# Altium project Service_eval_board.PrjPcb (part 3 of 3)

## Sheet Regulators.SchDoc
size A4; DocumentNumber: 7; SheetNumber: 7; SheetTotal: 10
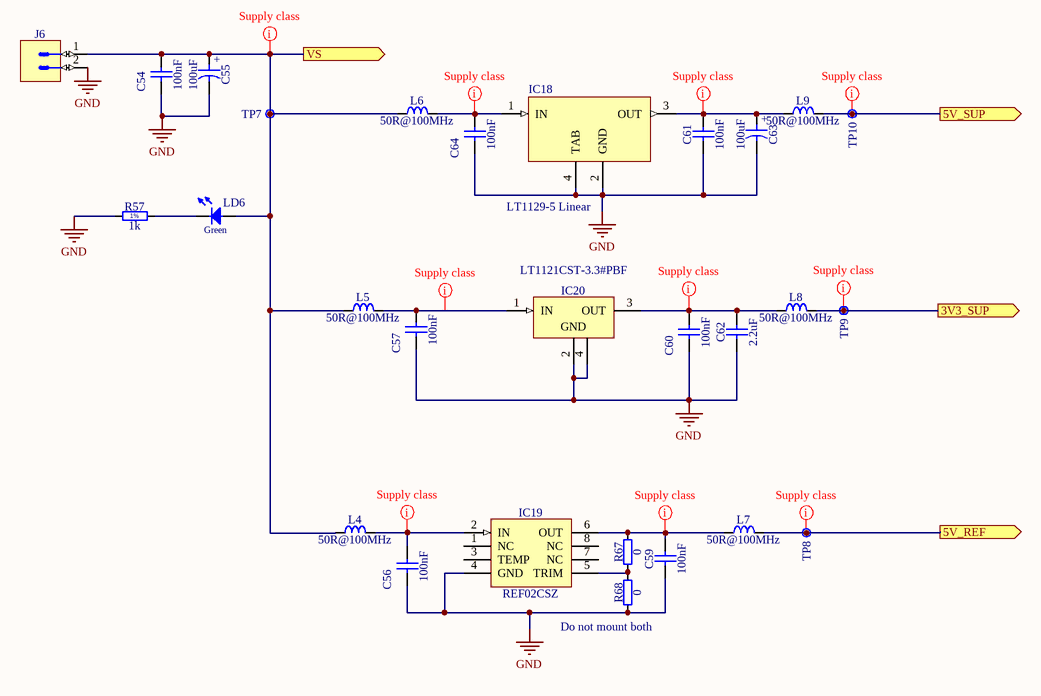
[diagram p9: Regulators.SchDoc]

### Parts
C54  100nF  [CAPC2012X135N]
C55  100uF  [CAPAE660X540N]
C56  100nF  [CAPC2012X135N]
C57  100nF  [CAPC2012X135N]
C59  100nF  [CAPC2012X135N]
C60  100nF  [CAPC2012X135N]
C61  100nF  [CAPC2012X135N]
C62  2.2uF  [CAPC2012X135N]
C63  100uF  [CAPAE660X540N]
C64  100nF  [CAPC2012X135N]
IC18  LT1129-5 Linear  [SOT230P700X175-4N]
IC19  REF02CSZ  [SOIC127P600X175-8N]
IC20  LT1121CST-3.3#PBF  [SOT230P700X180-4N]
J6  MATE-N-LOK  [TYCO_350786-1]  (value not drawn)
L4  50R@100MHz  [IND_MURATA_BLM31PG]
L5  50R@100MHz  [IND_MURATA_BLM31PG]
L6  50R@100MHz  [IND_MURATA_BLM31PG]
L7  50R@100MHz  [IND_MURATA_BLM31PG]
L8  50R@100MHz  [IND_MURATA_BLM31PG]
L9  50R@100MHz  [IND_MURATA_BLM31PG]
LD6  Green  [LED_OSRAM_LGR971]  (value not drawn)
R57  1k  [RESC2012X60N]
R67  0  [RESC2012X60N]
R68  0  [RESC2012X60N]
TP7  Test Point  [VERO_20-2136]  (value not drawn)
TP8  Test Point  [VERO_20-2136]  (value not drawn)
TP9  Test Point  [VERO_20-2136]  (value not drawn)
TP10  Test Point  [VERO_20-2136]  (value not drawn)

### Ports
3V3_SUP (out), 5V_REF (out), 5V_SUP (out), VS (out)

### Nets
DVDD: L8.2 TP9.1 ; port 3V3_SUP
GND: C54.1 C55.2 C56.1 C57.1 C59.1 C60.1 C61.1 C62.1 C63.2 C64.1 IC18.2(GND) IC18.4(TAB) IC19.4(GND) IC20.2(GND) IC20.4(GND) J6.2 R57.1 R68.1
NetC2_1: C54.2 C55.1 J6.1 L4.1 L5.1 L6.1 LD6.2(A) TP7.1 ; port VS
NetC45_1_1: L9.2 TP10.1 ; port 5V_SUP
NetC56_2: C56.2 IC19.2(IN) L4.2
NetC57_2: C57.2 IC20.1(IN) L5.2
NetC59_2: C59.2 IC19.6(OUT) L7.1 R67.2
NetC60_2: C60.2 C62.2 IC20.3(OUT) L8.1
NetC61_2: C61.2 C63.1 IC18.3(OUT) L9.1
NetC64_2: C64.2 IC18.1(IN) L6.2
NetIC19_5: IC19.5(TRIM) R67.1 R68.2
NetL7_2: L7.2 TP8.1 ; port 5V_REF
NetLD6_1: LD6.1(C) R57.2

Not connected (* = marked no-connect by the designer): IC19 1(NC) 3(TEMP) 7(NC) 8(NC)

### Layout directives
net class Supply: DVDD, NetC2_1, NetC45_1_1, NetC56_2, NetC57_2, NetC59_2, NetC60_2, NetC61_2, NetC64_2, NetL7_2

### Notes on the sheet
- (near R68) Do not mount both
- (in symbol CAE660-540_100UF_16V_20%) +
- (in symbol R0805_1K_1%_0.125W_100PPM) 1%

### Library data of the parts
C54 C56 C57 C59-C61 C64 = CC0805_100NF_50V_10%_X7R: as C51-C53 on sheet DAC; Part Number: CC0805_100NF_50V_10%_X7R; Component Kind: Standard; Component Type: Standard; Pin Count: 2; Value: 100nF; Status: Preferred; Manufacturer Part Number: CC0805_100NF_50V_10%_X7R; Case: 0805; Mounted: Yes; Socket: No; SMD: Yes; Sense: No; Manufacturer1 Example: TDK; Manufacturer1 ComponentHeight: 1mm; HelpURL: \\cern.ch\dfs\Applications\Altium\Datasheets\CC0805_X7R_TDK_C.pdf; Author: CERN DEM JLC; CreateDate: 03.12.2007; LatestRevisionDate: 22.04.2015
C55 C63 = CAE660-540_100UF_16V_20%: Polarised capacitor; Part Description: Aluminum Electrolytic SMT Capacitor; Manufacturer: PANASONIC; Manufacturer Part Number: EEEFK1C101AP; Voltage: 16V; Tolerance: ±20%; Part Number: CAE660-540_100UF_16V_20%; Component Kind: Standard; Component Type: Standard; Pin Count: 2; Value: 100uF; Status: Not Recommended; Case: D; Mounted: Yes; Socket: No; SMD: Yes; Sense: No; ComponentHeight: 5.8mm; HelpURL: \\cern.ch\dfs\Applications\Altium\Datasheets\CAE_PANASONIC_FK.pdf; Author: CERN DEM JLC; CreateDate: 03.12.2007; LatestRevisionDate: 05.11.2014
C62 = CC0805_2.2UF_16V_10%_X7R: Non-polarised capacitor; Part Description: SMD Multilayer Chip Ceramic Capacitor; Manufacturer: GENERIC; Manufacturer1 Part Number: GRM21BF51C225ZA01L; Voltage: 16V; TC: X7R; Tolerance: ±10%; Part Number: CC0805_2.2UF_16V_10%_X7R; Component Kind: Standard; Component Type: Standard; Pin Count: 2; Value: 2.2uF; Status: Preferred; Manufacturer Part Number: CC0805_2.2UF_16V_10%_X7R; Case: 0805; Mounted: Yes; Socket: No; SMD: Yes; Sense: No; Manufacturer1 Example: MURATA; Manufacturer1 ComponentHeight: 1.5mm; HelpURL: \\cern.ch\dfs\Applications\Altium\Datasheets\CC0805_X7R_MURATA_GRM.pdf; Author: CERN DEM JLC; CreateDate: 03.12.2007; LatestRevisionDate: 18.09.2014
IC18 = LT1129-5: Name: LT1129-5; Manufacturer: Linear
IC19 = REF02CSZ: Precision Voltage Reference/Temperature Transducer; Part Description: 5V Precision Voltage Reference/Temperature Transducer; Manufacturer: ANALOG DEVICES; PressFit: No; Bonding: No; Part Number: REF02CSZ; Component Kind: Standard; Component Type: Standard; Device: REF02CSZ; PackageDescription: SOIC 8, Pitch 1.27mm, Body 4x5mm, IPC Medium Density; Manufacturer Part Number: REF02CSZ; Pin Count: 8; Case: SOIC8; Mounted: Yes; Socket: No; SMD: Yes; Sense: No; ComponentHeight: 1.75mm; HelpURL: \\cern.ch\dfs\Applications\Altium\Datasheets\REF02CSZ.pdf; Author: CERN DEM JLC; CreateDate: 29.05.2008; LatestRevisionDate: 29.05.2008
IC20 = LT1121CST-3.3#PBF: 3-Terminal Regulator 1=IN 2=GND 3=OUT 4=GND; Part Description: 3.3V, 150mA Micropower Low-Dropout Regulator; Manufacturer: LINEAR TECHNOLOGY; PressFit: No; Bonding: No; Part Number: LT1121CST-3.3#PBF; Component Kind: Standard; Component Type: Standard; Device: LT1121CST-3.3#PBF; PackageDescription: SOT223, 2.30mm pitch; 3 pin, 3.70mm W X 6.70mm L, IPC Medium Density; Manufacturer Part Number: LT1121CST-3.3#PBF; Pin Count: 4; Case: SOT223; Mounted: Yes; Socket: No; SMD: Yes; Sense: No; ComponentHeight: 1.8mm; HelpURL: \\cern.ch\dfs\Applications\Altium\Datasheets\LT1121CST-3.3#PBF.pdf; Author: CERN DEM JLC; CreateDate: 24.06.2014; LatestRevisionDate: 24.06.2014
J6 = TYCO_350786-1: Connector 2 Male; Part Description: 2 Circuits In-Line - Universal MATE-N-LOK Connector; Manufacturer: TYCO ELECTRONICS; PressFit: No; Part Number: TYCO_350786-1; Component Kind: Standard; Component Type: Standard; Pin Count: 2; Family: MATE-N-LOK; Mounted: Yes; Socket: No; SMD: No; Sense: No; Status: None; Manufacturer Part Number: 350786-1; ComponentHeight: 14.73mm; HelpURL: \\cern.ch\dfs\Applications\Altium\Datasheets\TYCO_350786-1.pdf; Author: CERN DEM JMW; CreateDate: 04.06.2008; LatestRevisionDate: 04.06.2008
L4-L9 = IND1206_MURATA_BLM31PG500SN1: Inductor; Part Description: SMD EMIFIL Chip Ferrite Bead; Manufacturer: MURATA; Power: 3.5A; Resistance: 0.015R; Part Number: IND1206_MURATA_BLM31PG500SN1; Component Kind: Standard; Component Type: Standard; Pin Count: 2; Value: 50R@100MHz; Status: None; Manufacturer Part Number: BLM31PG500SN1; Case: 1206; Mounted: Yes; Socket: No; SMD: Yes; Sense: No; ComponentHeight: 1.3mm; HelpURL: \\cern.ch\dfs\Applications\Altium\Datasheets\IND1206_MURATA_BLM31P.pdf; Author: CERN DEM JLC; CreateDate: 05.12.2013; LatestRevisionDate: 05.12.2013
LD6 = LED_OSRAM_LGR971: LED Green 1C 2A; Part Description: Surface Mount Green LED (0805 Case); Manufacturer: OSRAM; Manufacturer Part Number: LGR971; PressFit: No; Bonding: No; Part Number: LED_OSRAM_LGR971; Component Kind: Standard; Component Type: Standard; Color: Green; PackageDescription: Green Chip LED, 2-Leads, Body 2.0x1.25mm, IPC Medium Density; Pin Count: 2; Case: 0805; Mounted: Yes; Socket: No; SMD: Yes; Sense: No; ComponentHeight: 0.9mm; HelpURL: \\cern.ch\dfs\Applications\Altium\Datasheets\LED_OSRAM_LGR971.pdf; Author: CERN DEM JLC; CreateDate: 28.01.2009; LatestRevisionDate: 17.03.2010
R57 = R0805_1K_1%_0.125W_100PPM: Resistor - 1%; Part Description: General Purpose Thick Film Chip Resistor; Manufacturer: GENERIC; Manufacturer1 Part Number: NRC10F1001TRF; Power: 0.125W; TC: ±100ppm/°C; PressFit: No; Part Number: R0805_1K_1%_0.125W_100PPM; Component Kind: Standard; Component Type: Standard; Pin Count: 2; Value: 1k; Status: Preferred; Tolerance: ±1%; Manufacturer Part Number: R0805_1K_1%_0.125W_100PPM; Case: 0805; Mounted: Yes; Sense: No; Socket: No; SMD: Yes; Manufacturer1 Example: NIC COMPONENT; Manufacturer1 ComponentHeight: 0.6mm; HelpURL: \\cern.ch\dfs\Applications\Altium\Datasheets\R0805_NIC_NRC.pdf; Author: CERN DEM JLC; CreateDate: 03.12.2007; LatestRevisionDate: 13.03.2008
R67 R68 = R0805_0R_JUMPER: Resistor; Part Description: 2A (0.05R Max DC Resistance) Zero Ohm Jumper; Manufacturer: GENERIC; Manufacturer1 Part Number: NRC10Z0; PressFit: No; Part Number: R0805_0R_JUMPER; Component Kind: Standard; Component Type: Standard; Pin Count: 2; Value: 0; Status: Preferred; Manufacturer Part Number: R0805_0R_JUMPER; Case: 0805; Mounted: Yes; Sense: No; Socket: No; SMD: Yes; Manufacturer1 Example: NIC COMPONENT; Manufacturer1 ComponentHeight: 0.6mm; HelpURL: \\cern.ch\dfs\Applications\Altium\Datasheets\R0805_NIC_NRC.pdf; Author: CERN DEM JLC; CreateDate: 03.12.2007; LatestRevisionDate: 13.03.2008
TP7-TP10 = VERO_20-2136: Part Description: Black Bead PCB Terminal Test Pin for 1.6mm PCB Thickness (1.32mm Hole); Manufacturer: VERO TECHNOLOGIES; PressFit: No; Part Number: VERO_20-2136; Component Kind: Standard; Component Type: Standard; Pin Count: 1; Family: Test Point; Mounted: Yes; Socket: No; SMD: No; Sense: No; Status: None; Manufacturer Part Number: 20-2136; ComponentHeight: 5.3mm; HelpURL: \\cern.ch\dfs\Applications\Altium\Datasheets\VERO_20-2136.pdf; Author: CERN DEM JLC; CreateDate: 21.07.2008; LatestRevisionDate: 15.07.2013

## Nets that join several sheets
DVDD: Pulser (12 pins), MCU (33 pins), Bank (C1.2 IC1.16), U_Bank/U_Channel/U_TRD (C49_1.2 U2_1.19 U2_1.20), U_Bank/U_Channel/U_TRD (C49_2.2 U2_2.19 U2_2.20), U_Bank/U_Channel/U_TRD (C49_3.2 U2_3.19 U2_3.20), U_Bank/U_Channel/U_TRD (C49_4.2 U2_4.19 U2_4.20), U_Bank/U_Channel/U_TRD (C49_5.2 U2_5.19 U2_5.20), U_Bank/U_Channel/U_TRD (C49_6.2 U2_6.19 U2_6.20), U_Bank/U_Channel/U_TRD (C49_7.2 U2_7.19 U2_7.20), U_Bank/U_Channel/U_TRD (C49_8.2 U2_8.19 U2_8.20), DAC (C53.2 IC16.12 IC16.15), Regulators (L8.2 TP9.1)
GND: Main (P3.3 P4.3), Pulser (71 pins), HV_boost (27 pins), MCU (29 pins), Bank (C1.1 IC1.8 IC1.13), U_Bank/U_Channel (IC2_1.10), U_Bank/U_Channel/U_Switch (22 pins), U_Bank/U_Channel/U_Switch (22 pins), U_Bank/U_Channel/U_TRD (7 pins), U_Bank/U_Channel/U_TRD (7 pins), U_Bank/U_Channel (IC2_2.10), U_Bank/U_Channel/U_Switch (22 pins), U_Bank/U_Channel/U_Switch (22 pins), U_Bank/U_Channel/U_TRD (7 pins), U_Bank/U_Channel/U_TRD (7 pins), U_Bank/U_Channel (IC2_3.10), U_Bank/U_Channel/U_Switch (22 pins), U_Bank/U_Channel/U_Switch (22 pins), U_Bank/U_Channel/U_TRD (7 pins), U_Bank/U_Channel/U_TRD (7 pins), U_Bank/U_Channel (IC2_4.10), U_Bank/U_Channel/U_Switch (22 pins), U_Bank/U_Channel/U_Switch (22 pins), U_Bank/U_Channel/U_TRD (7 pins), U_Bank/U_Channel/U_TRD (7 pins), DAC (8 pins), Regulators (18 pins)
VCC: U_Bank/U_Channel (IC2_1.20), U_Bank/U_Channel (IC2_2.20), U_Bank/U_Channel (IC2_3.20), U_Bank/U_Channel (IC2_4.20)
NetC2_1: HV_boost (8 pins), Regulators (8 pins)
NetC15_2: HV_boost (6 pins), U_Bank/U_Channel/U_Switch (R36_1.1 U1_1.4), U_Bank/U_Channel/U_Switch (R36_2.1 U1_2.4), U_Bank/U_Channel/U_Switch (R36_3.1 U1_3.4), U_Bank/U_Channel/U_Switch (R36_4.1 U1_4.4), U_Bank/U_Channel/U_Switch (R36_5.1 U1_5.4), U_Bank/U_Channel/U_Switch (R36_6.1 U1_6.4), U_Bank/U_Channel/U_Switch (R36_7.1 U1_7.4), U_Bank/U_Channel/U_Switch (R36_8.1 U1_8.4)
NetC45_1_1: Pulser (16 pins), U_Bank/U_Channel/U_Switch (19 pins), U_Bank/U_Channel/U_Switch (19 pins), U_Bank/U_Channel/U_Switch (19 pins), U_Bank/U_Channel/U_Switch (19 pins), U_Bank/U_Channel/U_Switch (19 pins), U_Bank/U_Channel/U_Switch (19 pins), U_Bank/U_Channel/U_Switch (19 pins), U_Bank/U_Channel/U_Switch (19 pins), DAC (R55.1), Regulators (L9.2 TP10.1)
NetD12_1: HV_boost (D12.1 R69.2), MCU (IC6.15)
NetIC1_1: Bank (IC1.1), U_Bank/U_Channel (IC2_1.19), U_Bank/U_Channel/U_TRD (U2_1.13)
NetIC1_2: Bank (IC1.2), U_Bank/U_Channel (IC2_2.1), U_Bank/U_Channel/U_TRD (U2_4.13)
NetIC1_3: Bank (IC1.3), U_Bank/U_Channel (IC2_2.19), U_Bank/U_Channel/U_TRD (U2_3.13)
NetIC1_4: Bank (IC1.4), U_Bank/U_Channel (IC2_3.1), U_Bank/U_Channel/U_TRD (U2_6.13)
NetIC1_5: Bank (IC1.5), U_Bank/U_Channel (IC2_3.19), U_Bank/U_Channel/U_TRD (U2_5.13)
NetIC1_6: Bank (IC1.6), U_Bank/U_Channel (IC2_4.1), U_Bank/U_Channel/U_TRD (U2_8.13)
NetIC1_7: Bank (IC1.7), U_Bank/U_Channel (IC2_4.19), U_Bank/U_Channel/U_TRD (U2_7.13)
NetIC1_9: MCU (IC6.45), Bank (IC1.9)
NetIC1_10: MCU (IC6.42), Bank (IC1.10)
NetIC1_11: MCU (IC6.43), Bank (IC1.11)
NetIC1_12: MCU (IC6.41), Bank (IC1.12)
NetIC1_14: MCU (IC6.44), Bank (IC1.14)
NetIC1_15: Bank (IC1.15), U_Bank/U_Channel (IC2_1.1), U_Bank/U_Channel/U_TRD (U2_2.13)
NetIC2_1_2: MCU (IC6.27), U_Bank/U_Channel (IC2_1.2 IC2_1.17), U_Bank/U_Channel (IC2_2.2 IC2_2.17), U_Bank/U_Channel (IC2_3.2 IC2_3.17), U_Bank/U_Channel (IC2_4.2 IC2_4.17)
NetIC2_1_3: U_Bank/U_Channel (IC2_1.3), U_Bank/U_Channel/U_Switch (R49_2.2)
NetIC2_1_4: MCU (IC6.26), U_Bank/U_Channel (IC2_1.4 IC2_1.15), U_Bank/U_Channel (IC2_2.4 IC2_2.15), U_Bank/U_Channel (IC2_3.4 IC2_3.15), U_Bank/U_Channel (IC2_4.4 IC2_4.15)
NetIC2_1_5: U_Bank/U_Channel (IC2_1.5), U_Bank/U_Channel/U_Switch (R48_2.2)
NetIC2_1_6: MCU (IC6.29), U_Bank/U_Channel (IC2_1.6 IC2_1.13), U_Bank/U_Channel (IC2_2.6 IC2_2.13), U_Bank/U_Channel (IC2_3.6 IC2_3.13), U_Bank/U_Channel (IC2_4.6 IC2_4.13)
NetIC2_1_7: U_Bank/U_Channel (IC2_1.7), U_Bank/U_Channel/U_Switch (IC11_2.4 R38_2.2)
NetIC2_1_8: U_Bank/U_Channel (IC2_1.8), U_Bank/U_Channel/U_Switch (IC13_1.5 LD5_1.2 T8_1.1)
NetIC2_1_11: U_Bank/U_Channel (IC2_1.11), U_Bank/U_Channel/U_Switch (IC13_2.5 LD5_2.2 T8_2.1)
NetIC2_1_14: U_Bank/U_Channel (IC2_1.14), U_Bank/U_Channel/U_Switch (IC11_1.4 R38_1.2)
NetIC2_1_16: U_Bank/U_Channel (IC2_1.16), U_Bank/U_Channel/U_Switch (R48_1.2)
NetIC2_1_18: U_Bank/U_Channel (IC2_1.18), U_Bank/U_Channel/U_Switch (R49_1.2)
NetIC2_2_3: U_Bank/U_Channel (IC2_2.3), U_Bank/U_Channel/U_Switch (R49_4.2)
NetIC2_2_5: U_Bank/U_Channel (IC2_2.5), U_Bank/U_Channel/U_Switch (R48_4.2)
NetIC2_2_7: U_Bank/U_Channel (IC2_2.7), U_Bank/U_Channel/U_Switch (IC11_4.4 R38_4.2)
NetIC2_2_8: U_Bank/U_Channel (IC2_2.8), U_Bank/U_Channel/U_Switch (IC13_3.5 LD5_3.2 T8_3.1)
NetIC2_2_11: U_Bank/U_Channel (IC2_2.11), U_Bank/U_Channel/U_Switch (IC13_4.5 LD5_4.2 T8_4.1)
NetIC2_2_14: U_Bank/U_Channel (IC2_2.14), U_Bank/U_Channel/U_Switch (IC11_3.4 R38_3.2)
NetIC2_2_16: U_Bank/U_Channel (IC2_2.16), U_Bank/U_Channel/U_Switch (R48_3.2)
NetIC2_2_18: U_Bank/U_Channel (IC2_2.18), U_Bank/U_Channel/U_Switch (R49_3.2)
NetIC2_3_3: U_Bank/U_Channel (IC2_3.3), U_Bank/U_Channel/U_Switch (R49_6.2)
NetIC2_3_5: U_Bank/U_Channel (IC2_3.5), U_Bank/U_Channel/U_Switch (R48_6.2)
NetIC2_3_7: U_Bank/U_Channel (IC2_3.7), U_Bank/U_Channel/U_Switch (IC11_6.4 R38_6.2)
NetIC2_3_8: U_Bank/U_Channel (IC2_3.8), U_Bank/U_Channel/U_Switch (IC13_5.5 LD5_5.2 T8_5.1)
NetIC2_3_11: U_Bank/U_Channel (IC2_3.11), U_Bank/U_Channel/U_Switch (IC13_6.5 LD5_6.2 T8_6.1)
NetIC2_3_14: U_Bank/U_Channel (IC2_3.14), U_Bank/U_Channel/U_Switch (IC11_5.4 R38_5.2)
NetIC2_3_16: U_Bank/U_Channel (IC2_3.16), U_Bank/U_Channel/U_Switch (R48_5.2)
NetIC2_3_18: U_Bank/U_Channel (IC2_3.18), U_Bank/U_Channel/U_Switch (R49_5.2)
NetIC2_4_3: U_Bank/U_Channel (IC2_4.3), U_Bank/U_Channel/U_Switch (R49_8.2)
NetIC2_4_5: U_Bank/U_Channel (IC2_4.5), U_Bank/U_Channel/U_Switch (R48_8.2)
NetIC2_4_7: U_Bank/U_Channel (IC2_4.7), U_Bank/U_Channel/U_Switch (IC11_8.4 R38_8.2)
NetIC2_4_8: U_Bank/U_Channel (IC2_4.8), U_Bank/U_Channel/U_Switch (IC13_7.5 LD5_7.2 T8_7.1)
NetIC2_4_11: U_Bank/U_Channel (IC2_4.11), U_Bank/U_Channel/U_Switch (IC13_8.5 LD5_8.2 T8_8.1)
NetIC2_4_14: U_Bank/U_Channel (IC2_4.14), U_Bank/U_Channel/U_Switch (IC11_7.4 R38_7.2)
NetIC2_4_16: U_Bank/U_Channel (IC2_4.16), U_Bank/U_Channel/U_Switch (R48_7.2)
NetIC2_4_18: U_Bank/U_Channel (IC2_4.18), U_Bank/U_Channel/U_Switch (R49_7.2)
NetIC6_20: MCU (IC6.20), DAC (IC16.9)
NetIC6_21: MCU (IC6.21), DAC (IC16.10)
NetIC6_22: MCU (IC6.22), DAC (IC16.11)
NetIC6_23: MCU (IC6.23 TP5.1), U_Bank/U_Channel/U_Switch (IC11_1.1), U_Bank/U_Channel/U_Switch (IC11_2.1), U_Bank/U_Channel/U_Switch (IC11_3.1), U_Bank/U_Channel/U_Switch (IC11_4.1), U_Bank/U_Channel/U_Switch (IC11_5.1), U_Bank/U_Channel/U_Switch (IC11_6.1), U_Bank/U_Channel/U_Switch (IC11_7.1), U_Bank/U_Channel/U_Switch (IC11_8.1)
NetIC6_33: MCU (IC6.33), U_Bank/U_Channel/U_TRD (U2_1.18), U_Bank/U_Channel/U_TRD (U2_2.18), U_Bank/U_Channel/U_TRD (U2_3.18), U_Bank/U_Channel/U_TRD (U2_4.18), U_Bank/U_Channel/U_TRD (U2_5.18), U_Bank/U_Channel/U_TRD (U2_6.18), U_Bank/U_Channel/U_TRD (U2_7.18), U_Bank/U_Channel/U_TRD (U2_8.18)
NetIC6_34: MCU (IC6.34), U_Bank/U_Channel/U_TRD (U2_1.12), U_Bank/U_Channel/U_TRD (U2_2.12), U_Bank/U_Channel/U_TRD (U2_3.12), U_Bank/U_Channel/U_TRD (U2_4.12), U_Bank/U_Channel/U_TRD (U2_5.12), U_Bank/U_Channel/U_TRD (U2_6.12), U_Bank/U_Channel/U_TRD (U2_7.12), U_Bank/U_Channel/U_TRD (U2_8.12)
NetIC6_35: MCU (IC6.35), U_Bank/U_Channel/U_TRD (U2_1.14), U_Bank/U_Channel/U_TRD (U2_2.14), U_Bank/U_Channel/U_TRD (U2_3.14), U_Bank/U_Channel/U_TRD (U2_4.14), U_Bank/U_Channel/U_TRD (U2_5.14), U_Bank/U_Channel/U_TRD (U2_6.14), U_Bank/U_Channel/U_TRD (U2_7.14), U_Bank/U_Channel/U_TRD (U2_8.14)
NetIC6_36: MCU (IC6.36), U_Bank/U_Channel/U_TRD (U2_1.11), U_Bank/U_Channel/U_TRD (U2_2.11), U_Bank/U_Channel/U_TRD (U2_3.11), U_Bank/U_Channel/U_TRD (U2_4.11), U_Bank/U_Channel/U_TRD (U2_5.11), U_Bank/U_Channel/U_TRD (U2_6.11), U_Bank/U_Channel/U_TRD (U2_7.11), U_Bank/U_Channel/U_TRD (U2_8.11)
NetIC6_56: MCU (IC6.56), U_Bank/U_Channel (R1_1.1 R2_1.1), U_Bank/U_Channel (R1_2.1 R2_2.1), U_Bank/U_Channel (R1_3.1 R2_3.1), U_Bank/U_Channel (R1_4.1 R2_4.1)
NetIC6_61: HV_boost (LD1.2 R3.1 T1.1), MCU (IC6.61)
NetIC6_62: Pulser (SW7.1), MCU (IC6.62)
NetL7_2: Main (P3.1 P4.1), Pulser (P6.1), HV_boost (P1.1), DAC (R56.1), Regulators (L7.2 TP8.1)
NetR40_1_1: Main (SW3.2), U_Bank/U_Channel/U_Switch (R40_1.1), U_Bank/U_Channel/U_Switch (R40_2.1), U_Bank/U_Channel/U_Switch (R40_3.1), U_Bank/U_Channel/U_Switch (R40_4.1), U_Bank/U_Channel/U_Switch (R40_5.1), U_Bank/U_Channel/U_Switch (R40_6.1), U_Bank/U_Channel/U_Switch (R40_7.1), U_Bank/U_Channel/U_Switch (R40_8.1)
NetR41_1_1: Main (SW4.2), U_Bank/U_Channel/U_Switch (R41_1.1), U_Bank/U_Channel/U_Switch (R41_2.1), U_Bank/U_Channel/U_Switch (R41_3.1), U_Bank/U_Channel/U_Switch (R41_4.1), U_Bank/U_Channel/U_Switch (R41_5.1), U_Bank/U_Channel/U_Switch (R41_6.1), U_Bank/U_Channel/U_Switch (R41_7.1), U_Bank/U_Channel/U_Switch (R41_8.1)
OUTA: Main (SW4.1), DAC (IC16.1)
OUTB: Main (SW3.1), DAC (IC16.2)
OUTC: HV_boost (SW2.3), DAC (IC16.7)
OUTD: Pulser (SW6.3), DAC (IC16.8)
W_A0: MCU (D6.2 IC4.8), U_Bank/U_Channel/U_Switch (IC14_1.5 LD4_1.2)
W_A1: MCU (D5.2 IC4.6), U_Bank/U_Channel/U_Switch (IC14_3.5 LD4_3.2)
W_A2: MCU (D4.2 IC4.4), U_Bank/U_Channel/U_Switch (IC14_5.5 LD4_5.2)
W_A3: MCU (D3.2 IC4.2), U_Bank/U_Channel/U_Switch (IC14_7.5 LD4_7.2)
W_B0: MCU (D10.2 IC4.11), U_Bank/U_Channel/U_Switch (IC14_2.5 LD4_2.2)
W_B1: MCU (D9.2 IC4.13), U_Bank/U_Channel/U_Switch (IC14_4.5 LD4_4.2)
W_B2: MCU (D8.2 IC4.15), U_Bank/U_Channel/U_Switch (IC14_6.5 LD4_6.2)
W_B3: MCU (D7.2 IC4.17), U_Bank/U_Channel/U_Switch (IC14_8.5 LD4_8.2)